# EasyEDA Pro project 干电池充电器.eprj, board PCB1
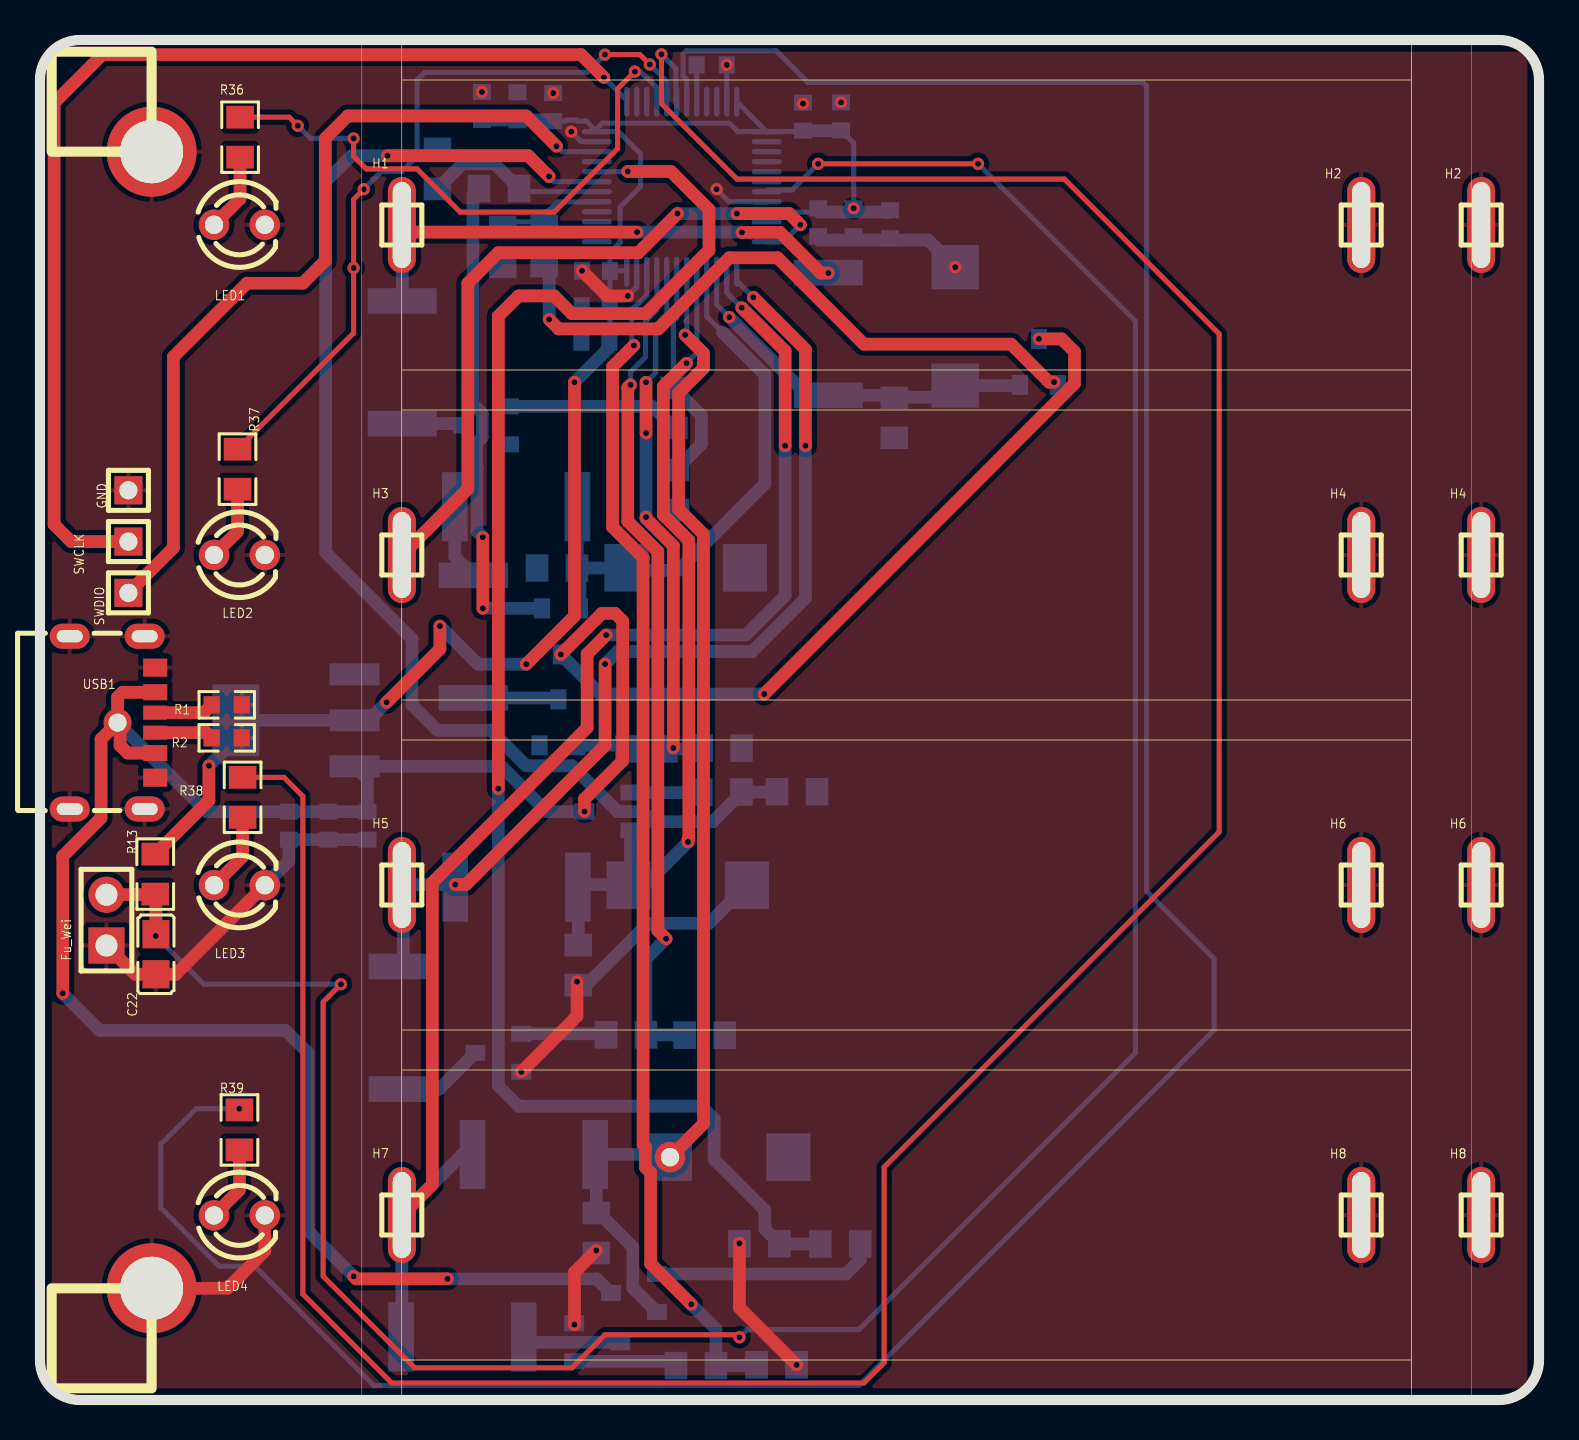
[diagram p1: board, top side]
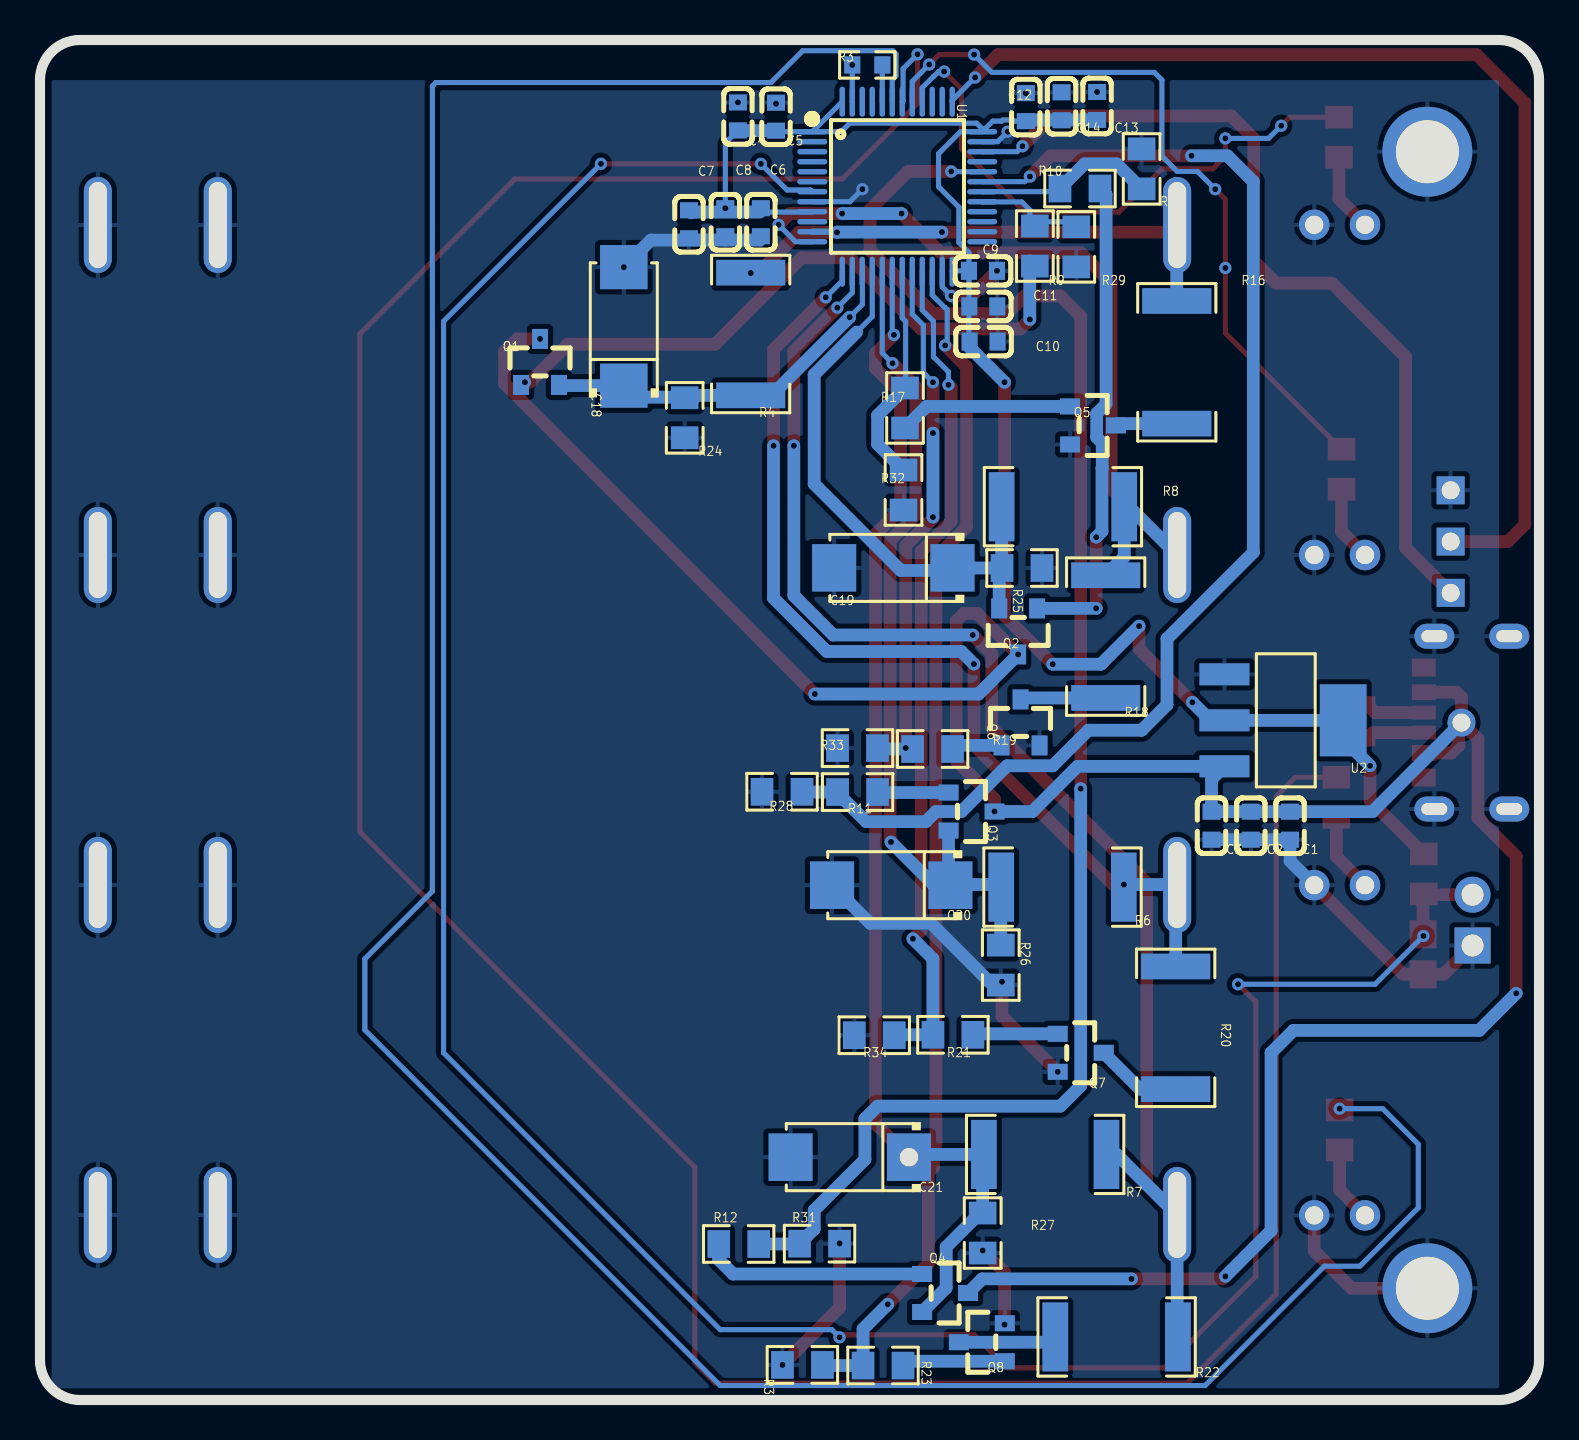
[diagram p2: board, bottom side, seen from below]

Outline 75 x 68 mm; copper layers: Top Layer, Bottom Layer. Coordinates in mm from the lower left corner of the outline.
Outline path: 0,66 0,2 arc(0.59,0.59) 2,0 73,0 arc(74.41,0.59) 75,2 75,66 arc(74.41,67.41) 73,68 2,68 arc(0.59,67.41) 0,66
Stack: Top Layer 0.035mm / Dielectric1 1.51mm FR4 er 4.5 / Bottom Layer 0.035mm

## Design rules (mm)
template: 自定义配置
spacing copperThickness1oz (default): track to track 0.102, other pairs 0.152 to 0.3
spacing copperThickness2oz: track to track 0.203, other pairs 0.152 to 0.3
track width copperThickness1oz (default): min 0.127, default 0.254, max 2.54
track width copperThickness2oz: min 0.203, default 0.254, max 2.54
differential pair differentialPair (default): width min 0.127, default 0.254, max 2.54; gap min 0.152, default 0.152
via viaSize (default): diameter min 0.5, default 0.61, max 10; hole min 0.3, default 0.305, max 6.3

## Placement (name value [footprint] x y rotation side)
C1  10uf  [C0603]  12.46 28.72 90 bottom
C2  1uf  [C0603]  14.42 28.72 90 bottom
C3  0.1uf  [C0603]  16.39 28.72 90 bottom
C4  1uf  [C0603]  40.08 64.18 270 bottom
C5  0.1uf  [C0603]  38.17 64.17 270 bottom
C6  10uf  [C0603]  38.93 58.89 270 bottom
C7  1uf  [C0603]  42.53 58.79 270 bottom
C8  0.1uf  [C0603]  40.71 58.89 270 bottom
C9  10uf  [C0603]  27.82 56.46 180 bottom
C10  1uf  [C0603]  27.79 52.92 180 bottom
C11  0.1uf  [C0603]  27.8 54.68 180 bottom
C12  10uf  [C0603]  25.68 64.64 90 bottom
C13  1uf  [C0603]  22.11 64.7 90 bottom
C14  0.1uf  [C0603]  23.89 64.69 90 bottom
C18  220uF  [CAP-SMD_L6.0-W3.2]  45.79 53.68 90 bottom
C19  220uF  [CAP-SMD_L6.0-W3.2]  32.3 41.61 0 bottom
C20  220uF  [CAP-SMD_L6.0-W3.2]  32.41 25.74 0 bottom
C21  220uF  [CAP-SMD_L6.0-W3.2]  34.48 12.14 0 bottom
C22  1uf  [C0805]  5.8 22.29 90 top
Fu_Wei  -  [HDR-TH_2P-P2.54-V-M-1]  3.33 23.99 90 top
GND  -  [HDR-TH_1P-V-M_XKB_X4611WV-01I-C28D40#2]  4.42 45.48 90 top
H1  -  [HDR-TH_1P-V-M_XKB_X4611WV-01I-C28D40]  18.1 58.75 0 top
H2  -  [HDR-TH_1P-V-M_XKB_X4611WV-01I-C28D40]  72.11 58.75 0 top
H2#2  -  [HDR-TH_1P-V-M_XKB_X4611WV-01I-C28D40]  66.11 58.75 0 top
H3  -  [HDR-TH_1P-V-M_XKB_X4611WV-01I-C28D40]  18.1 42.25 0 top
H4  -  [HDR-TH_1P-V-M_XKB_X4611WV-01I-C28D40]  66.11 42.25 0 top
H4#2  -  [HDR-TH_1P-V-M_XKB_X4611WV-01I-C28D40]  72.11 42.25 0 top
H5  -  [HDR-TH_1P-V-M_XKB_X4611WV-01I-C28D40]  18.1 25.75 0 top
H6  -  [HDR-TH_1P-V-M_XKB_X4611WV-01I-C28D40]  66.11 25.75 0 top
H6#2  -  [HDR-TH_1P-V-M_XKB_X4611WV-01I-C28D40]  72.11 25.75 0 top
H7  -  [HDR-TH_1P-V-M_XKB_X4611WV-01I-C28D40]  18.1 9.25 0 top
H8  -  [HDR-TH_1P-V-M_XKB_X4611WV-01I-C28D40]  72.11 9.25 0 top
H8#2  -  [HDR-TH_1P-V-M_XKB_X4611WV-01I-C28D40]  66.11 9.25 0 top
LED1  -  [LED_TH-3mm]  9.98 58.76 0 top
LED2  -  [LED_TH-3mm]  9.98 42.25 0 top
LED3  -  [LED_TH-3mm]  9.98 25.74 0 top
LED4  -  [LED_TH-3mm]  9.98 9.23 0 top
NOREF  -  [Pad_e197]  5.59 5.59 180 top
NOREF#2  -  [Pad_e825]  31.52 12.14 0 top
NOREF#3  -  [Pad_e180]  3.88 33.87 180 top
NOREF#4  -  [Pad_e195]  5.59 62.41 180 top
Q1  -  [S8050_SOT-23]  50.11 51.9 270 bottom
Q2  -  [S8050_SOT-23]  25.93 38.43 90 bottom
Q3  -  [S8050_SOT-23]  28.39 29.55 0 bottom
Q4  -  [S8050_SOT-23]  29.72 5.48 0 bottom
Q5  AO3400  [SOT-23_L2.9-W1.3-P1.90-LS2.4-BR]  22.31 48.73 0 bottom
Q6  AO3400  [SOT-23_L2.9-W1.3-P1.90-LS2.4-BR]  25.94 33.88 270 bottom
Q7  AO3400  [SOT-23_L2.9-W1.3-P1.90-LS2.4-BR]  22.93 17.36 0 bottom
Q8  AO3400  [SOT-23_L2.9-W1.3-P1.90-LS2.4-BR]  27.88 2.89 180 bottom
R1  5k1  [R0603]  9.34 34.76 0 top
R2  5K1  [R0603]  9.34 33.11 0 top
R3  5K1  [R0603]  33.61 66.75 0 bottom
R4  100mΩ  [R2512]  39.44 53.3 270 bottom
R6  100mΩ  [R2512]  23.84 25.64 0 bottom
R7  100mΩ  [R2512]  24.71 12.28 0 bottom
R8  100mΩ  [R2512]  23.82 44.66 0 bottom
R9  200  [R0805]  25.22 57.7 90 bottom
R10  200  [R0805]  22.97 60.57 0 bottom
R11  200  [R0805]  34.09 30.4 0 bottom
R12  200  [R0805]  40.04 7.8 180 bottom
R13  10K  [R0805]  5.77 26.3 90 top
R16  3Ω  [R2512]  18.12 51.88 270 bottom
R17  200  [R0805]  31.72 49.6 270 bottom
R18  3Ω  [R2512]  21.68 38.17 270 bottom
R19  200  [R0805]  30.34 32.55 180 bottom
R20  3Ω  [R2512]  18.18 18.61 270 bottom
R21  200  [R0805]  29.32 18.26 180 bottom
R22  3Ω  [R2512]  21.13 3.15 0 bottom
R23  200  [R0805]  32.82 1.72 180 bottom
R24  47K  [R0805]  42.74 49.11 270 bottom
R25  47K  [R0805]  25.87 41.6 180 bottom
R26  47K  [R0805]  26.93 21.75 270 bottom
R27  47K  [R0805]  27.83 8.35 270 bottom
R28  47K  [R0805]  37.87 30.41 0 bottom
R29  47K  [R0805]  23.15 57.66 270 bottom
R30  47K  [R0805]  19.88 61.56 90 bottom
R31  47K  [R0805]  36 7.82 180 bottom
R32  47K  [R0805]  31.8 45.5 270 bottom
R33  47K  [R0805]  34.1 32.59 0 bottom
R34  47K  [R0805]  33.26 18.24 0 bottom
R35  47K  [R0805]  36.85 1.76 0 bottom
R36  1K  [R0805]  10.01 63.14 270 top
R37  1K  [R0805]  9.88 46.54 270 top
R38  1K  [R0805]  10.14 30.13 270 top
R39  1K  [R0805]  9.98 13.5 270 top
SWCLK  -  [HDR-TH_1P-V-M_XKB_X4611WV-01I-C28D40#2]  4.42 42.92 90 top
SWDIO  -  [HDR-TH_1P-V-M_XKB_X4611WV-01I-C28D40#2]  4.42 40.36 90 top
U1  STM32F103C8T6  [LQFP-48_L7.0-W7.0-P0.50-LS9.0-BL]  32.11 60.67 270 bottom
U2  AMS1117-3.3  [SOT-223-3_L6.5-W3.4-P2.30-LS7.0-BR]  12.77 33.98 0 bottom
USB1  -  [USB_ TYPE-C-6P]  3.63 34 270 top

## Footprints (pads in the part's own frame, mm; a bottom-side part is the same pattern mirrored in y, then rotated)
C0603
  rect 0.8x0.9 smd: 1(-0.7,0) 2(0.7,0)
C0805
  rect 1.41x1.35 smd: 1(-1,0) 2(1,0)
CAP-SMD_L6.0-W3.2
  rect 2.208x2.376 smd: 1(-2.962,0) 2(2.962,0)
HDR-TH_1P-V-M_XKB_X4611WV-01I-C28D40
  oval 1.4x4.8 hole 0.9x4.3: 1(0,0)
HDR-TH_1P-V-M_XKB_X4611WV-01I-C28D40#2
  rect 1.4x1.4 hole 0.9: 1(0,0)
HDR-TH_2P-P2.54-V-M-1
  rect 1.8x1.8 hole 1.1: 1(-1.27,0)
  round 1.8 hole 1.1: 2(1.27,0)
LED_TH-3mm
  round 1.524 hole 0.914: 1(-1.27,0) 2(1.27,0)
LQFP-48_L7.0-W7.0-P0.50-LS9.0-BL
  oval 0.27x1.5 smd: 1(-2.75,-4.25) 2(-2.25,-4.25) 3(-1.75,-4.25) 4(-1.25,-4.25) 5(-0.75,-4.25) 6(-0.25,-4.25) 7(0.25,-4.25) 8(0.75,-4.25) 9(1.25,-4.25) 10(1.75,-4.25) 11(2.25,-4.25) 12(2.75,-4.25) 25(2.75,4.25) 26(2.25,4.25) 27(1.75,4.25) 28(1.25,4.25) 29(0.75,4.25) 30(0.25,4.25) 31(-0.25,4.25) 32(-0.75,4.25) 33(-1.25,4.25) 34(-1.75,4.25) 35(-2.25,4.25) 36(-2.75,4.25)
  oval 1.5x0.27 smd: 13(4.25,-2.75) 14(4.25,-2.25) 15(4.25,-1.75) 16(4.25,-1.25) 17(4.25,-0.75) 18(4.25,-0.25) 19(4.25,0.25) 20(4.25,0.75) 21(4.25,1.25) 22(4.25,1.75) 23(4.25,2.25) 24(4.25,2.75) 37(-4.25,2.75) 38(-4.25,2.25) 39(-4.25,1.75) 40(-4.25,1.25) 41(-4.25,0.75) 42(-4.25,0.25) 43(-4.25,-0.25) 44(-4.25,-0.75) 45(-4.25,-1.25) 46(-4.25,-1.75) 47(-4.25,-2.25) 48(-4.25,-2.75)
Pad_e180
  oval 1.4x1.4 hole 0.9: 1(0,0)
Pad_e195
  round 4.5 hole 3.15: 1(0,0)
Pad_e197
  round 4.5 hole 3.15: 1(0,0)
Pad_e825
  round 1.524 hole 0.914: 1(0,0)
R0603
  rect 0.806x0.864 smd: 1(-0.753,0) 2(0.753,0)
R0805
  rect 1.133x1.377 smd: 1(-1,0) 2(1,0)
R2512
  rect 1.282x3.456 smd: 1(-3.067,0) 2(3.067,0)
S8050_SOT-23
  rect 1x0.8 smd: 1(1.15,-0.823) 2(1.15,1.077) 3(-1.15,0.127)
SOT-23_L2.9-W1.3-P1.90-LS2.4-BR
  rect 1x0.8 smd: 1(1.15,-0.95) 2(1.15,0.95) 3(-1.15,0)
SOT-223-3_L6.5-W3.4-P2.30-LS7.0-BR
  rect 2.5x1.1 smd: 1(2.97,-2.3) 2(2.97,0) 3(2.97,2.3)
  rect 2.34x3.6 smd: 4(-2.97,0)
USB_ TYPE-C-6P
  oval 1.25x2 hole 0.6x1.3: 7(-4.193,1.611) 8(4.447,1.611) 9(-4.193,-2.139) 10(4.447,-2.139)
  rect 0.7x1.2 smd: A5(-0.373,2.139) B5(0.627,2.139)
  rect 0.8x1.2 smd: A9(1.647,2.139) B9(-1.393,2.139)
  rect 0.9x1.2 smd: A12(2.877,2.139) B12(-2.623,2.139)

## Nets
+5V: C1.2 C2.2 C3.2 NOREF#3.1 Q1.3 Q2.3 Q3.3 Q4.3 U2.3 USB1.A9 USB1.B9
GND: C1.1 C2.1 C3.1 C4.1 C5.1 C6.2 C7.2 C8.2 C9.2 C10.2 C11.2 C12.2 C13.2 C14.2 C18.2 C19.2 C20.2 C21.2 C22.1 Fu_Wei.1 GND.1 H2.1 H2#2.1 H4.1 H4#2.1 H6.1 H6#2.1 H8.1 H8#2.1 LED1.2 LED2.2 LED3.2 LED4.2 NOREF.1 NOREF#4.1 Q5.2 Q6.2 Q7.2 Q8.2 R1.2 R2.2 R3.2 R24.2 R25.2 R26.2 R27.2 R28.2 R29.2 R30.2 R31.2 R32.2 R33.2 R34.2 R35.2 U1.8 U1.23 U1.35 U1.47 U2.1 USB1.7 USB1.8 USB1.9 USB1.10 USB1.A12 USB1.B12
VCC: C4.2 C5.2 C6.1 C7.1 C8.1 C9.1 C10.1 C11.1 C12.1 C13.1 C14.1 R13.2 U1.1 U1.9 U1.24 U1.36 U1.48 U2.2 U2.4
ADC_1: H1.1 R4.1 R16.1 U1.11
ADC_2: H3.1 R8.1 R18.1 U1.12
ADC_3: H5.1 R6.1 R20.1 U1.13
ADC_4: H7.1 R7.1 R22.1 U1.14
ADC_CU_1: C18.1 Q1.2 R4.2 R24.1 U1.15
ADC_CU_2: C19.1 Q2.2 R8.2 R25.1 U1.16
ADC_CU_3: C20.1 Q3.2 R6.2 R26.1 U1.17
ADC_CU_4: C21.1 NOREF#2.1 Q4.2 R7.2 R27.1 U1.18
CHG_SW1: R9.2 R29.1 U1.29
CHG_SW2: R10.2 R30.1 U1.30
CHG_SW3: R11.2 R28.1 U1.31
CHG_SW4: R12.2 R31.1 U1.32
DIS_CHG_SW1: R17.1 R32.1 U1.19
DIS_CHG_SW2: R19.1 R33.1 U1.20
DIS_CHG_SW3: R21.1 R34.1 U1.21
DIS_CHG_SW4: R23.1 R35.1 U1.22
LED1: R36.1 U1.40
LED2: R37.1 U1.41
LED3: R38.1 U1.42
LED4: R39.1 U1.43
RESET: C22.2 Fu_Wei.2 R13.1 U1.7
$1N759: R1.1 USB1.A5
$1N785: R2.1 USB1.B5
$1N1881: R3.1 U1.44
$1N2574: SWDIO.1 U1.34
$1N2624: SWCLK.1 U1.37
$1N2965: Q1.1 R9.1
$1N2970: Q2.1 R10.1
$1N2976: Q3.1 R11.1
$1N2981: Q4.1 R12.1
$1N4284: Q5.3 R16.2
$1N4449: Q5.1 R17.2
$1N4597: Q6.3 R18.2
$1N4599: Q6.1 R19.2
$1N4723: Q7.3 R20.2
$1N4725: Q7.1 R21.2
$1N4849: Q8.3 R22.2
$1N4851: Q8.1 R23.2
$1N5986: LED1.1 R36.2
$1N6012: LED2.1 R37.2
$1N6038: LED3.1 R38.2
$1N6064: LED4.1 R39.2

Pads without a net: U1 2 3 4 5 6 10 25 26 27 28 33 38 39 45 46

## Via types
v1: diameter 0.61, hole 0.305, Top Layer to Bottom Layer, 78 vias

## Routing (per net, layer and track width the routed paths; a pad name or vN(x,y) marks a point on that pad's centre or on a via; arc(x,y) is an arc through that point)
+5V: length 140.2
  Top Layer w0.635: v1(26.06,37.28) 28.11,39.33 28.77,39.33 29.15,38.95 29.15,31.96 27.24,30.05 v1(27.24,29.42) ; v1(49.98,53.05) 51.12,53.05 51.76,52.41 51.76,50.82 v1(36.23,35.3) ; v1(15.69,6.18) 15.82,6.06 v1(20.39,6.06) ; NOREF#3.1 3.06,33.04 3.06,29.11 1.14,27.19 v1(1.14,20.33) ; NOREF#3.1 4.01,33.74 4.01,32.73 4.38,32.35 USB1.A9 ; NOREF#3.1 3.88,35.14 4.13,35.39 USB1.B9
  Bottom Layer w0.635: v1(36.23,35.3) 28.04,35.3 v1(26.06,37.28) ; Q4.3 27.86,6.06 v1(20.39,6.06) ; v1(15.69,6.18) 13.41,8.47 13.41,17.36 12.28,18.48 2.99,18.48 v1(1.14,20.33) ; v1(27.24,29.42) 25.34,29.42 23.08,31.68 U2.3 16.39,31.04 C3.2 C2.2 C1.2 8.33,29.42 NOREF#3.1
GND: length 70.5
  Top Layer w0.635: LED4.2 11.25,7.45 9.38,5.59 NOREF.1 ; v1(27.12,56.46) 28.37,55.21 v1(29.41,55.21) ; v1(24.08,16.41) 26.87,19.2 v1(26.87,20.92) ; v1(37.85,1.76) 35,4.61 v1(35,7.83) ; v1(27.83,7.48) 26.74,6.38 v1(26.74,3.77) ; Fu_Wei.1 4.76,21.29 C22.1 6.79,21.29 LED3.2
  Bottom Layer w0.254: v1(34.36,66.75) 34.36,64.92 U1.47 ; U1.8 34.48,59.92 v1(33.85,60.54) ; v1(29.41,55.21) 29.86,55.66 U1.23 ; v1(26.58,63.42) 27.08,62.92 U1.35
  Bottom Layer w0.635: LED3.2 12.46,26.95 12.46,28.02 16.39,28.02 ; 38.97,58 44.44,58 v1(45.79,56.64) ; v1(26.87,20.92) 27.5,20.92 30.42,23.84 33.47,23.84 C20.2
  vias: v1(22.11,65.4) v1(25.68,65.34) v1(38.17,64.82) v1(40.08,64.88)
VCC: length 88.7
  Top Layer w0.635: v1(17.34,34.89) 20.01,37.55 v1(20.01,38.7) ; v1(24.33,36.79) 26.74,39.2 v1(26.74,50.89) ; v1(8.45,31.71) 8.45,29.98 R13.2
  Bottom Layer w0.254: U1.36 27.86,63.56 28.14,63.84 34.49,63.84 34.91,63.42 U1.1 ; U1.36 27.33,63.94 26.88,63.94 26.83,64 26.34,64 26.28,63.94 C12.1 ; U1.36 28.94,63.42 30.04,62.32 30.04,60.67 29.03,59.65 29.03,57.88 28.52,57.38 C9.1 ; v1(40.71,59.59) 40.71,62.85 C4.2 ; C10.1 28.52,52.95 C9.1 ; C9.1 29.32,56.46 U1.24 ; U1.1 U1.48 ; U1.1 38.17,63.42 ; U1.9 36.38,59.4 38.97,59.4
  Bottom Layer w0.635: C5.2 40.06,63.47 C4.2 ; C10.1 28.49,52.64 v1(26.74,50.89) ; C12.1 25.62,64 C13.1 ; v1(24.33,36.79) 21.92,36.79 v1(20.01,38.7) ; 38.97,59.4 42.36,59.4 42.4,59.36 ; v1(8.45,31.71) 9.8,33.06 U2.4 U2.2 16.44,33.98 v1(17.34,34.89)
ADC_1: length 27.6
  Top Layer w0.635: v1(39.44,56.35) 39.06,56.35 37.03,58.38 v1(35.12,58.38) ; v1(29.87,58.4) 18.46,58.4 H1.1
  Bottom Layer w0.254: 39.36,56.37 39.57,56.37
  Bottom Layer w0.305: v1(35.12,58.38) 35.16,58.42 U1.11
  Bottom Layer w0.635: H1.1 18.12,58.73 R16.1 ; v1(35.12,58.38) 35.11,58.4 v1(29.87,58.4)
ADC_2: length 42.8
  Top Layer w0.635: v1(38.04,58.76) 37.48,59.32 v1(34.87,59.32) ; H3.1 21.41,45.55 21.41,55.84 22.93,57.36 29.94,57.36 v1(31.89,59.32)
  Bottom Layer w0.254: U1.12 37.2,57.92 v1(38.04,58.76)
  Bottom Layer w0.635: v1(31.89,59.32) v1(34.87,59.32) ; 21.68,41.23 20.75,42.16 R8.1 20.52,44.66 H3.1
ADC_3: length 50.4
  Top Layer w0.635: v1(28.27,36.8) 28.27,32.73 21.31,25.77 v1(20.77,25.77) ; v1(38.3,47.71) 38.3,52.52 v1(35.69,55.13)
  Bottom Layer w0.254: U1.13 34.86,55.96 v1(35.69,55.13)
  Bottom Layer w0.635: v1(28.27,36.8) 28.9,37.43 35.63,37.43 38.3,40.09 v1(38.3,47.71) ; R20.1 18.18,25.68 H5.1 18.13,25.77 v1(20.77,25.77)
ADC_4: length 71.3
  Top Layer w0.635: v1(28.33,38.25) 27.38,37.3 27.38,33.62 19.63,25.87 19.63,10.77 H7.1 ; v1(35.11,54.62) 37.28,52.44 v1(37.28,47.71)
  Bottom Layer w0.254: U1.14 34.36,55.37 v1(35.11,54.62)
  Bottom Layer w0.635: R22.1 18.1,3.19 H7.1 21.13,12.28 R7.1 ; v1(28.33,38.25) 35.31,38.25 37.28,40.22 v1(37.28,47.71)
ADC_CU_1: length 19
  Bottom Layer w0.254: v1(34.49,54.14) 33.85,54.78 33.85,56.41 U1.15
  Bottom Layer w0.635: v1(34.49,54.14) 38.4,50.23 R4.2 42.14,50.23 42.23,50.14 45.21,50.14 C18.1 49,50.72 Q1.2
ADC_CU_2: length 28.2
  Bottom Layer w0.254: 34.14,53.4 33.36,54.18 U1.16
  Bottom Layer w0.635: 34.14,53.4 36.27,51.27 36.27,45.81 31.94,41.48 29.72,41.48 29.6,41.61 29.34,41.61 29.34,41.6 R25.1 ; R25.1 27.01,41.46 Q2.2 ; R25.1 26.89,41.62 R8.2
ADC_CU_3: length 41.9
  Top Layer w0.635: v1(32.35,51.84) 31.19,50.68 31.19,44.26 32.46,42.98 32.46,28.07 32.42,28.03 v1(32.42,27.9)
  Bottom Layer w0.254: U1.17 32.86,52.35 v1(32.35,51.84)
  Bottom Layer w0.635: Q3.2 29.54,25.84 C20.1 ; C20.1 30.26,25.74 v1(32.42,27.9) ; C20.1 29.42,25.77 26.91,25.77 26.93,25.75 26.93,22.87
ADC_CU_4: length 59.4
  Top Layer w0.635: NOREF#2.1 33.2,13.82 33.2,43.29 31.95,44.54 31.95,50.34 33.2,51.59 33.2,52.33 v1(32.27,53.26)
  Bottom Layer w0.254: U1.18 32.36,53.34 v1(32.27,53.26)
  Bottom Layer w0.635: Q4.2 29.66,5.6 29.66,7.65 27.83,9.48 27.83,12.22 R7.2 31.39,12.28 NOREF#2.1
CHG_SW1: length 4.8
  Bottom Layer w0.254: U1.29 27.85,59.9 25.88,59.9 25.48,59.5 25.48,58.95 25.44,58.91 23.79,58.91
CHG_SW2: length 9.1
  Bottom Layer w0.254: R10.2 24.13,60.42 U1.30
  Bottom Layer w0.635: R30.1 21.14,61.81 22.73,61.81 R10.2
CHG_SW3: length 63.9
  Top Layer w0.635: v1(25.47,61.17) 24.43,62.21 v1(17.38,62.21)
  Bottom Layer w0.254: v1(25.47,61.17) 25.73,60.92 U1.31
  Bottom Layer w0.635: v1(17.38,62.21) 15.59,62.21 14.3,60.92 14.3,42.38 18.61,38.06 18.61,34.76 19.88,33.49 22.55,33.49 24.33,31.71 26.61,31.71 28.9,29.42 30.17,29.42 30.68,28.92 33.66,28.92 35.09,30.35 R11.2 36.86,30.4 R28.1
CHG_SW4: length 80.7
  Top Layer w0.635: v1(22.93,30.57) 22.93,54.19 23.95,55.21 25.72,55.21 26.61,54.32 30.3,54.32 33.47,57.49 33.47,59.52 31.57,61.43 v1(29.41,61.43)
  Bottom Layer w0.254: U1.32 29.4,61.42 v1(29.41,61.43)
  Bottom Layer w0.635: v1(22.93,30.57) 22.93,15.71 23.95,14.69 33.09,14.69 33.73,14.06 33.73,12.03 36.27,9.49 36.27,8.55 R31.1 37.01,7.8 R12.2
DIS_CHG_SW1: length 11.1
  Bottom Layer w0.254: U1.19 31.86,54.1 31.69,53.93 31.69,50.63
  Bottom Layer w0.635: R32.1 33.09,47.79 33.09,49.23 R17.1
DIS_CHG_SW2: length 26.6
  Top Layer w0.635: v1(30.32,48.35) v1(30.32,50.89) ; v1(31.69,32.6) 31.69,42.71 30.32,44.08 v1(30.32,44.15)
  Bottom Layer w0.254: v1(30.32,50.89) 30.8,51.37 30.8,53.74 31.36,54.3 U1.20
  Bottom Layer w0.635: R19.1 33.05,32.55 R33.1 ; v1(30.32,44.15) v1(30.32,48.35)
DIS_CHG_SW3: length 41.9
  Top Layer w0.635: v1(29.55,50.76) 29.41,50.62 29.41,43.93 30.91,42.42 30.91,23.48 v1(31.33,23.06)
  Bottom Layer w0.254: U1.21 30.86,54.5 30.3,53.94 30.3,52.16 29.55,51.41 v1(29.55,50.76)
  Bottom Layer w0.635: R34.1 32.24,18.26 R21.1 30.32,22.06 v1(31.33,23.06)
DIS_CHG_SW4: length 59.6
  Top Layer w0.635: v1(32.58,4.79) 30.55,6.82 30.55,11.37 30.29,11.63 30.29,12.65 30.17,12.77 30.17,42.12 28.65,43.65 28.65,51.66 v1(29.71,52.73)
  Bottom Layer w0.254: U1.22 30.36,55.25 29.73,54.62 29.71,54.62 29.61,54.52 29.61,52.83 v1(29.71,52.73)
  Bottom Layer w0.635: 35.73,1.76 35.69,1.72 R23.1 33.82,3.55 v1(32.58,4.79)
LED1: length 29
  Top Layer w0.254: v1(15.69,63.08) 15.69,62.19 16.33,61.56 18.87,61.56 21.03,59.4 25.73,59.4 28.9,62.57 28.9,65.56 v1(29.76,66.42) ; v1(12.9,63.71) 12.47,64.14 R36.1
  Bottom Layer w0.254: v1(15.69,63.08) 13.53,63.08 v1(12.9,63.71) ; U1.40 30.86,65.62 30.28,66.19 30.27,66.19 30.04,66.42 v1(29.76,66.42)
LED2: length 37.4
  Top Layer w0.254: v1(30.51,66.78) 30.02,67.27 v1(28.27,67.27) ; R37.1 15.69,53.35 v1(15.69,56.6) 15.69,60.03 v1(16.2,60.54)
  Bottom Layer w0.254: v1(30.51,66.78) 31.36,65.93 U1.41 ; v1(28.27,67.27) 27.38,66.38 19.25,66.38 18.87,66 18.87,62.19 18.1,61.43 17.09,61.43 v1(16.2,60.54)
LED3: length 155.8
  Top Layer w0.254: v1(31.09,67.28) 31.09,64.82 34.87,61.05 51.25,61.05 59,53.3 59,28.41 42.23,11.64 42.23,1.87 41.22,0.85 17.6,0.85 13.15,5.29 13.15,30.19 12.2,31.13 R38.1
  Bottom Layer w0.254: v1(31.09,67.28) 31.82,66.56 31.82,64.96 U1.42
LED4: length 146.7
  Bottom Layer w0.254: v1(9.98,14.57) 7.82,14.57 6.04,12.79 6.04,9.61 8.96,6.69 10.74,6.69 16.71,0.72 40.96,0.72 58.74,18.5 58.74,22.06 55.37,25.43 55.37,65.69 55.19,65.87 38.42,65.87 36.83,67.46 32.34,67.46 32.17,67.3 32.17,66.21 32.36,66.02 U1.43
RESET: length 137.7
  Top Layer w0.254: v1(15.06,20.79) 14.17,19.9 14.17,6.18 18.74,1.61 26.61,1.61 28.27,3.26 34.87,3.26 v1(35,3.14) ; v1(38.93,61.81) v1(46.93,61.81)
  Top Layer w0.635: Fu_Wei.2 5.74,25.26 R13.1 5.8,25.26 C22.2
  Bottom Layer w0.254: v1(35,3.14) 35.38,3.52 40.96,3.52 54.81,17.36 54.81,53.94 v1(46.93,61.81) ; U1.7 36.45,60.5 37.63,60.5 v1(38.93,61.81) ; v1(5.79,23.2) 8.2,20.79 v1(15.06,20.79)
$1N759: length 2.6
  Top Layer w0.635: R1.1 8.2,34.37 6.15,34.37
$1N785: length 2.6
  Top Layer w0.635: R2.1 8.33,33.37 6.15,33.37
$1N1881: length 1.8
  Bottom Layer w0.254: U1.44 32.86,66.75 R3.1
$1N2574: length 43.2
  Top Layer w0.635: SWDIO.1 6.67,42.61 6.67,52.16 10.36,55.84 13.15,55.84 14.27,56.96 14.27,63.08 15.4,64.2 24.33,64.2 v1(25.84,62.69)
  Bottom Layer w0.254: U1.34 26.11,62.42 v1(25.84,62.69)
$1N2624: length 55.8
  Top Layer w0.635: SWCLK.1 1.56,42.92 0.71,43.78 0.71,64.86 3.12,67.27 27.07,67.27 v1(28.21,66.13)
  Bottom Layer w0.254: v1(28.21,66.13) 29.36,64.98 U1.37
$1N2965: length 32.4
  Top Layer w0.635: v1(50.74,50.9) 50.48,50.9 48.58,52.79 41.22,52.79 36.9,57.11 34.49,57.11 30.93,53.55 25.95,53.55 v1(25.48,54.03)
  Bottom Layer w0.635: 25.48,56.95 v1(25.48,54.03)
$1N2970: length 24.5
  Top Layer w0.635: v1(22.16,43.14) v1(22.16,39.58)
  Bottom Layer w0.635: v1(22.16,39.58) 25.1,39.58 Q2.1 ; v1(22.16,43.14) 21.86,43.43 21.86,46.59 21.85,46.6 21.85,47.86 22.13,48.13 22.13,49.32 21.66,49.79 21.66,60.27 R10.1
$1N2976: length 3.6
  Bottom Layer w0.635: Q3.1 33.07,30.37 R11.1
$1N2981: length 11.3
  Bottom Layer w0.635: R12.1 41.04,7.02 40.32,6.3 Q4.1
$1N4284: length 3.1
  Bottom Layer w0.635: R16.2 21.07,48.82 Q5.3
$1N4449: length 8.7
  Bottom Layer w0.635: R17.2 30.64,49.68 Q5.1
$1N4597: length 4.3
  Bottom Layer w0.635: Q6.3 25.87,35.1 R18.2
$1N4599: length 2.5
  Bottom Layer w0.635: R19.2 29.16,32.73 Q6.1
$1N4723: length 4.4
  Bottom Layer w0.635: R20.2 19.97,15.54 Q7.3
$1N4725: length 4.3
  Bottom Layer w0.635: Q7.1 28.27,18.31 R21.2
$1N4849: length 4.9
  Bottom Layer w0.635: Q8.3 24.47,2.89 24.2,3.15
$1N4851: length 5.2
  Bottom Layer w0.635: Q8.1 31.61,1.94 R23.2
$1N5986: length 3.9
  Top Layer w0.635: R36.2 10.01,60.07 LED1.1
$1N6012: length 3.8
  Top Layer w0.635: R37.2 9.88,43.43 LED2.1
$1N6038: length 4
  Top Layer w0.635: R38.2 10.14,27.17 LED3.1
$1N6064: length 3.8
  Top Layer w0.635: R39.2 9.98,10.5 LED4.1

## Copper pours and planes (outline as drawn; the poured copper is in the pictures)
GND on Top Layer: 0.59,67.41 74.41,67.41 74.41,0.59 0.59,0.59
GND on Bottom Layer: 2,66 74.41,66 74.41,0.59 2,0.59
